# EAGLE design ConnectBox_Charger (EAGLE 9.2.2)
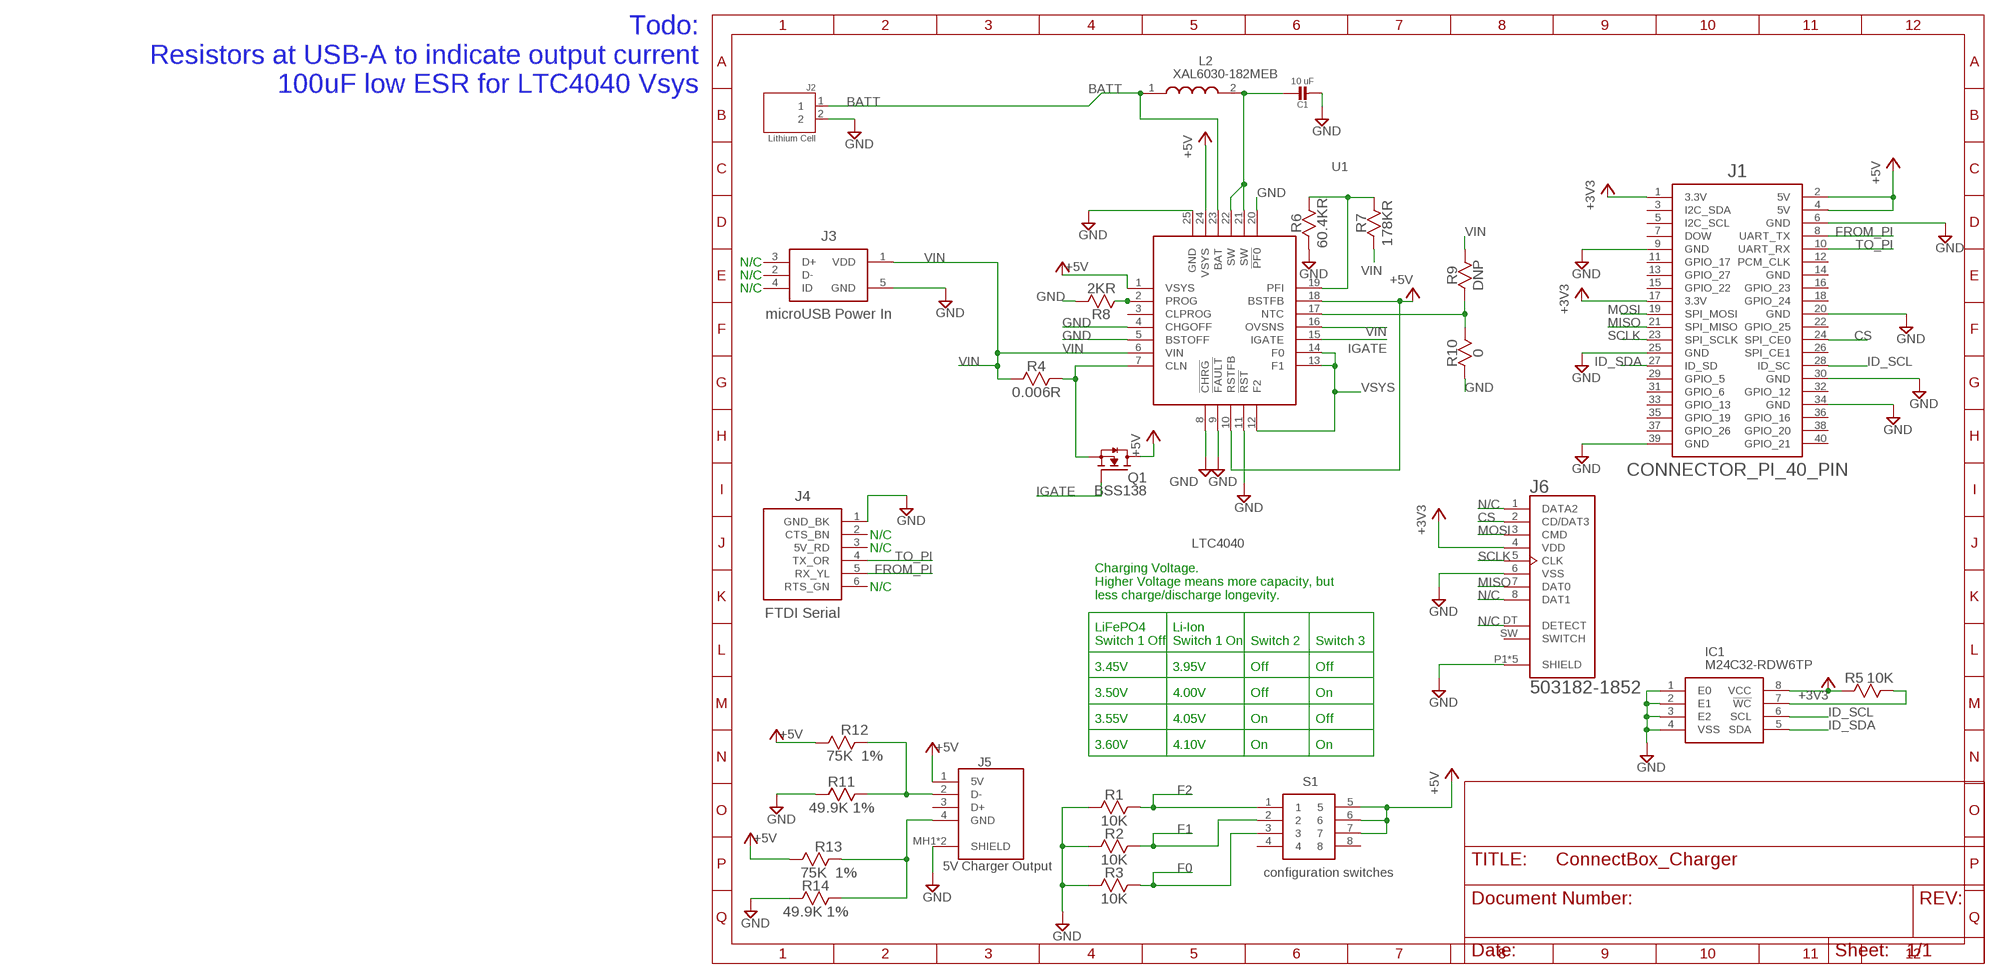
[diagram p0: schematic, sheet 1]

## Parts
C1  10 uF  MICROBUILDER_CAP_CERAMIC0805_10MGAP  [MICROBUILDER_0805_10MGAP]
IC1  M24C32-RDW6TP  [SOP65P640X120-8N]
J1  CONNECTOR_PI_40_PIN  [2X20]
J2  Lithium Cell  S2B-PH-SM4-TB(LF)(SN)  [JST_S2B-PH-SM4-TB(LF)(SN)]
J3  microUSB Power In  10118194-0001LF  [FRAMATOME_10118194-0001LF]
J4  FTDI Serial  CONNECTOR-6-FTDI  [ESQ-106-XX-X-S]
J5  5V Charger Output  SS-52100-001  [SS52100001]
J6  503182-1852  [MOLEX_503182-1852]
L2  XAL6030-182MEB  [XAL6030182MEB]
Q1  BSS138  [BSS138]
R1  10K  RESISTOR0603  [RESC1608X55L25N]
R2  10K  RESISTOR0603  [RESC1608X55L25N]
R3  10K  RESISTOR0603  [RESC1608X55L25N]
R4  0.006R  RESISTOR0603  [RESC1608X55L25N]
R5  10K  RESISTOR0603  [RESC1608X55L25N]
R6  60.4KR  RESISTOR0603  [RESC1608X55L25N]
R7  178KR  RESISTOR0603  [RESC1608X55L25N]
R8  2KR  RESISTOR0603  [RESC1608X55L25N]
R9  DNP  RESISTOR0603  [RESC1608X55L25N]
R10  0  RESISTOR0603  [RESC1608X55L25N]
R11  49.9K 1%  RESISTOR0603  [RESC1608X55L25N]
R12  75K 1%  RESISTOR0603  [RESC1608X55L25N]
R13  75K 1%  RESISTOR0603  [RESC1608X55L25N]
R14  49.9K 1%  RESISTOR0603  [RESC1608X55L25N]
S1  configuration switches  219-4LPST  [219-4LPST]
U1  LTC4040  [QFN50P500X400X80-25N]

## Nets
+3V3: IC1.8(VCC) J1.1(3.3V) J1.17(3.3V) J6.4(VDD) R5.2
+5V: J1.2(5V) J1.4(5V) J5.1(5V) Q1.D R12.2 R13.2 S1.5 S1.6 S1.7 U1.1(VSYS) U1.10(RSTFB) U1.18(BSTFB) U1.24(VSYS)
BATT: J2.1 L2.1 U1.23(BAT)
CS: J1.24(SPI_CE0) J6.2(CD/DAT3)
F0: R3.2 S1.3
F1: R2.2 S1.2
F2: R1.2 S1.1
FROM_PI: J1.8(UART_TX) J4.5(RX_YL)
GND [wide]: C1.2 IC1.1(E0) IC1.2(E1) IC1.3(E2) IC1.4(VSS) J1.6(GND) J1.9(GND) J1.20(GND) J1.25(GND) J1.30(GND) J1.34(GND) J1.39(GND) J2.2 J3.5(GND) J4.1(GND_BK) J5.MH1(SHIELD) J5.MH2(SHIELD) J6.6(VSS) J6.P1(SHIELD) J6.P2(SHIELD) J6.P3(SHIELD) J6.P4(SHIELD) J6.P5(SHIELD) R1.1 R2.1 R3.1 R6.1 R8.2 R10.1 R11.2 R14.2 U1.4(CHGOFF) U1.5(BSTOFF) U1.8(!CHRG) U1.9(!FAULT) U1.11(!RST) U1.20(!PF0) U1.25(GND)
ID_SCL: IC1.6(SCL) J1.28(ID_SC)
ID_SDA: IC1.5(SDA) J1.27(ID_SD)
IGATE: Q1.G U1.15(IGATE)
MISO: J1.21(SPI_MISO) J6.7(DAT0)
MOSI: J1.19(SPI_MOSI) J6.3(CMD)
N$2: Q1.S R4.2 U1.7(CLN)
N$3: IC1.7(!WC) R5.1
N$4: R6.2 R7.2 U1.19(PFI)
N$5 [wide]: C1.1 L2.2 U1.21(SW) U1.22(SW)
N$6: R8.1 U1.2(PROG)
N$8 [wide]: J5.4(GND) R13.1 R14.1
N$9: R9.1 R10.2 U1.17(NTC)
N$11: J5.2(D-) R11.1 R12.1
N/C: J6.1(DATA2) J6.8(DAT1) J6.DT(DETECT)
SCLK: J1.23(SPI_SCLK) J6.5(CLK)
TO_PI: J1.10(UART_RX) J4.4(TX_OR)
VIN: J3.1(VDD) R4.1 R7.1 R9.2 U1.6(VIN) U1.16(OVSNS)
VSYS: U1.12(F2) U1.13(F1) U1.14(F0)
Unconnected: J1.3(I2C_SDA) J1.5(I2C_SCL) J1.7(DOW) J1.11(GPIO_17) J1.12(PCM_CLK) J1.13(GPIO_27) J1.14(GND) J1.15(GPIO_22) J1.16(GPIO_23) J1.18(GPIO_24) J1.22(GPIO_25) J1.26(SPI_CE1) J1.29(GPIO_5) J1.31(GPIO_6) J1.32(GPIO_12) J1.33(GPIO_13) J1.35(GPIO_19) J1.36(GPIO_16) J1.37(GPIO_26) J1.38(GPIO_20) J1.40(GPIO_21) J3.2(D-) J3.3(D+) J3.4(ID) J4.2(CTS_BN) J4.3(5V_RD) J4.6(RTS_GN) J5.3(D+) J6.SW(SWITCH) S1.4 S1.8 U1.3(CLPROG)

## Notes on the sheet
- Todo:
  Resistors at USB-A to indicate output current
  100uF low ESR for LTC4040 Vsys
- N/C
- N/C
- N/C
- N/C
- N/C
- N/C
- Charging Voltage.
  Higher Voltage means more capacity, but
  less charge/discharge longevity.
- LiFePO4
  Switch 1 Off
- Li-Ion
  Switch 1 On
- Switch 2 | Switch 3
- 3.45V | 3.95V | Off | Off
- 3.50V | 4.00V | Off | On
- 3.55V | 4.05V | On | Off
- 3.60V | 4.10V | On | On

## Library data of the parts
C1 = Adafruit LoRa Radio Bonnet with OLED:MICROBUILDER_CAP_CERAMIC: Ceramic Capacitors For new designs, use the packages preceded by an '_' character since they are more reliable: The following footprints should be used on most boards: _0402 - Standard footprint for regular board layouts _0603 - Standard footprint for regular board layouts _0805 - Standard footprint for regular board layouts _1206 - Standard footprint for regular board layouts For extremely tight-pitch boards where space is at a premium, the following 'micro-pitch' footprints can be used (smaller pads, no silkscreen outline, etc.): _0402MP - Micro-pitch footprint for very dense/compact boards _0603MP - Micro-pitch footprint for very dense/compact boards _0805MP - Micro-pitch footprint for very dense/compact boards _1206MP - Micro-pitch footprint for very dense/compact boards
IC1 = ConnectBox_2019:M24C32-RDW6TP: STMICROELECTRONICS - M24C32-RDW6TP - EEPROM, 32KBIT, I2C, 1MHZ, TSSOP-8 Source: Datasheet <http://www.st.com/content/ccc/resource/technical/document/datasheet/80/4e/8c/54/f2/63/4c/4a/CD00001012.pdf/files/CD00001012.pdf/jcr:content/translations/en.CD00001012.pdf>; DESCRIPTION: STMICROELECTRONICS - M24C32-RDW6TP - EEPROM, 32KBIT, I2C, 1MHZ, TSSOP-8; HEIGHT: 1.2mm; MANUFACTURER_NAME: STMicroelectronics; MANUFACTURER_PART_NUMBER: M24C32-RDW6TP; MOUSER_PART_NUMBER: 511-M24C32-RDW6TP; MOUSER_PRICE-STOCK: https://www.mouser.com/Search/Refine.aspx?Keyword=511-M24C32-RDW6TP
J1 = ConnectBox_2019:CONNECTOR_PI_40_PIN
J2 = ConnectBox_2019:S2B-PH-SM4-TB(LF)(SN): PH Series 2 Position 2 mm Pitch Surface Mount Side Entry Shrouded Header; AVAILABILITY: Unavailable; DESCRIPTION: PH Series 2 Position 2 mm Pitch Surface Mount Side Entry Shrouded Header; MF: JST Sales; MP: S2B-PH-SM4-TB_LF__SN_; PACKAGE: FakePackage u; PRICE: None
J3 = ConnectBox_2019:10118194-0001LF: Conn Micro USB Type B RCP 5 POS 0.65mm Solder RA SMD 5 Terminal 1 Port T/R from SnapEDA; AVAILABILITY: Good; DESCRIPTION: Conn Micro USB Type B RCP 5 POS 0.65mm Solder RA SMD 5 Terminal 1 Port T/R; MF: FCI; MP: 10118194-0001LF; PACKAGE: DIP-4 FCI; PRICE: 0.24 USD
J4 = ConnectBox_2019:CONNECTOR-6-FTDI
J5 = ConnectBox_2019:SS-52100-001: STEWART CONNECTOR - SS-52100-001 - USB CONN, 2.0 TYPE A, RCPT, 4POS, TH Source: Datasheet <https://componentsearchengine.com/Datasheets/1/SS-52100-001.pdf>; DESCRIPTION: STEWART CONNECTOR - SS-52100-001 - USB CONN, 2.0 TYPE A, RCPT, 4POS, TH; HEIGHT: 6.9mm; MANUFACTURER_NAME: Bel-Stewart; MANUFACTURER_PART_NUMBER: SS-52100-001; MOUSER_PART_NUMBER: 530-SS-52100-001; MOUSER_PRICE-STOCK: https://www.mouser.com/Search/Refine.aspx?Keyword=530-SS-52100-001
J6 = 503182-1852:503182-1852: Conn Micro SD Card M 8 POS 1.09mm Solder RA SMD Embossed T/R 0.5A/Contact; DESCRIPTION: MICRO SD NORMAL ULTRALOWPRO8CKTE; DIGI-KEY_PART_NUMBER: WM12834CT-ND; DIGI-KEY_PURCHASE_URL: https://www.digikey.com/product-detail/en/molex/5031821852/WM12834CT-ND/5823232?utm_source=snapeda&utm_medium=aggregator&utm_campaign=symbol; MF: Molex; MP: 5031821852; PACKAGE: None
L2 = ConnectBox_2019:XAL6030-182MEB: Fixed Inductors 1.8uH 20% 14A 10.52mOhms AEC-Q200 Source: Datasheet <https://www.coilcraft.com/pdfs/xal60xx.pdf>; DESCRIPTION: Fixed Inductors 1.8uH 20% 14A 10.52mOhms AEC-Q200; HEIGHT: 3.1mm; MANUFACTURER_NAME: COILCRAFT; MANUFACTURER_PART_NUMBER: XAL6030-182MEB; MOUSER_PART_NUMBER: 994-XAL6030-182MEB; MOUSER_PRICE-STOCK: https://www.mouser.com/Search/Refine.aspx?Keyword=994-XAL6030-182MEB
Q1 = APU_ENGR480_UPS_EAGLE_Library:BSS138: BSS138 N-Channel Logic Level Enhancement Mode Field Effect Transistor from SnapEDA; AVAILABILITY: Good; DESCRIPTION: B138 Series 50 V 6 Ohms N-Ch Logic Level Enhancement Mode FET - SOT-23-3; MF: Fairchild Semiconductor; MP: BSS138; PACKAGE: SOT-23-3 Fairchild Semiconductor; PRICE: 19.46 USD
R1-R14 = ConnectBox_2019:RESISTOR
S1 = ConnectBox_2019:219-4LPST: Series 219, SMD DIP-switch Source: Datasheet <http://www.ctscorp.com/wp-content/uploads/2015/11/219.pdf>; DESCRIPTION: Series 219, SMD DIP-switch; HEIGHT: mm; MANUFACTURER_NAME: CTS; MANUFACTURER_PART_NUMBER: 219-4LPST; MOUSER_PART_NUMBER: 774-2194LPST; MOUSER_PRICE-STOCK: https://www.mouser.com/Search/Refine.aspx?Keyword=774-2194LPST; RS_PART_NUMBER: 1774220; RS_PRICE-STOCK: http://uk.rs-online.com/web/p/products/1774220
U1 = ConnectBox_2019:LTC4040

## Net classes
1 wide: width 0.076 mm

## Board
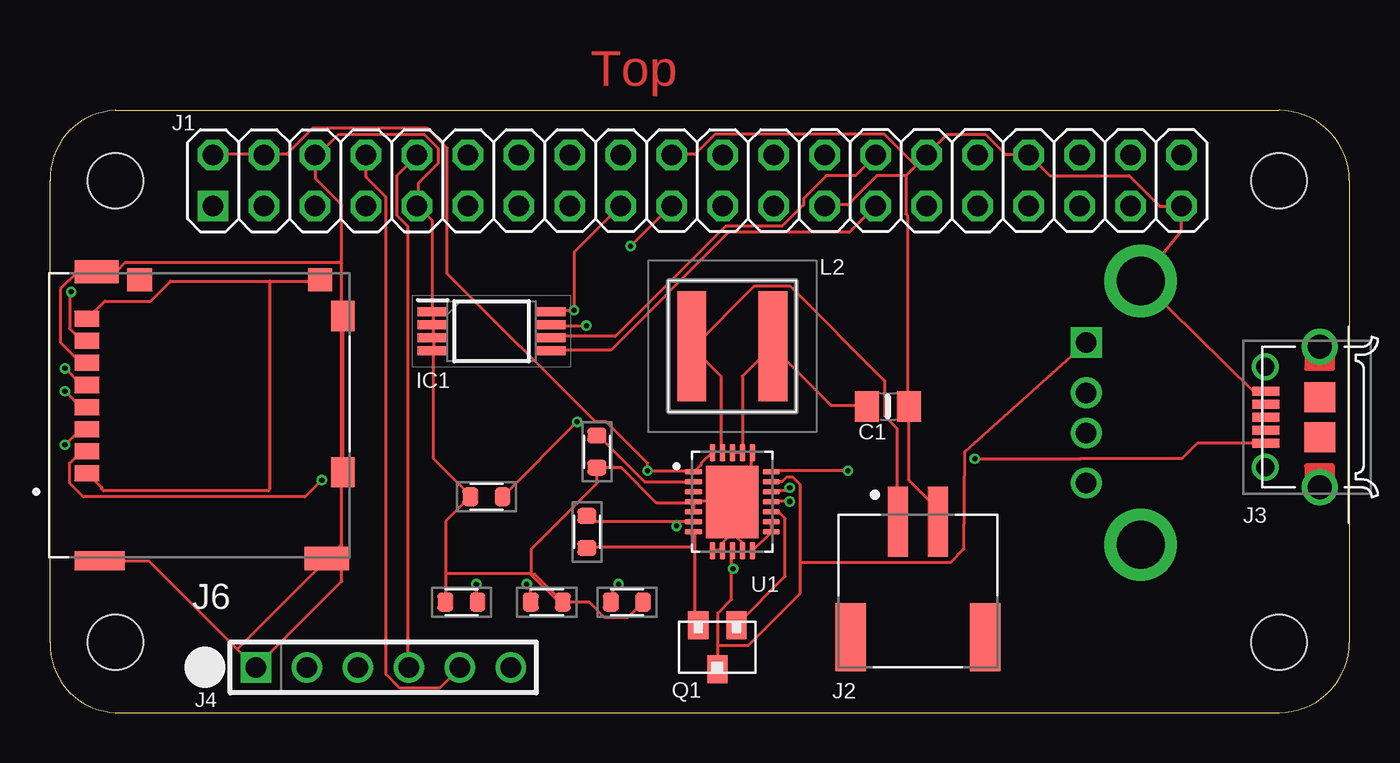
[diagram p1: board, top side]
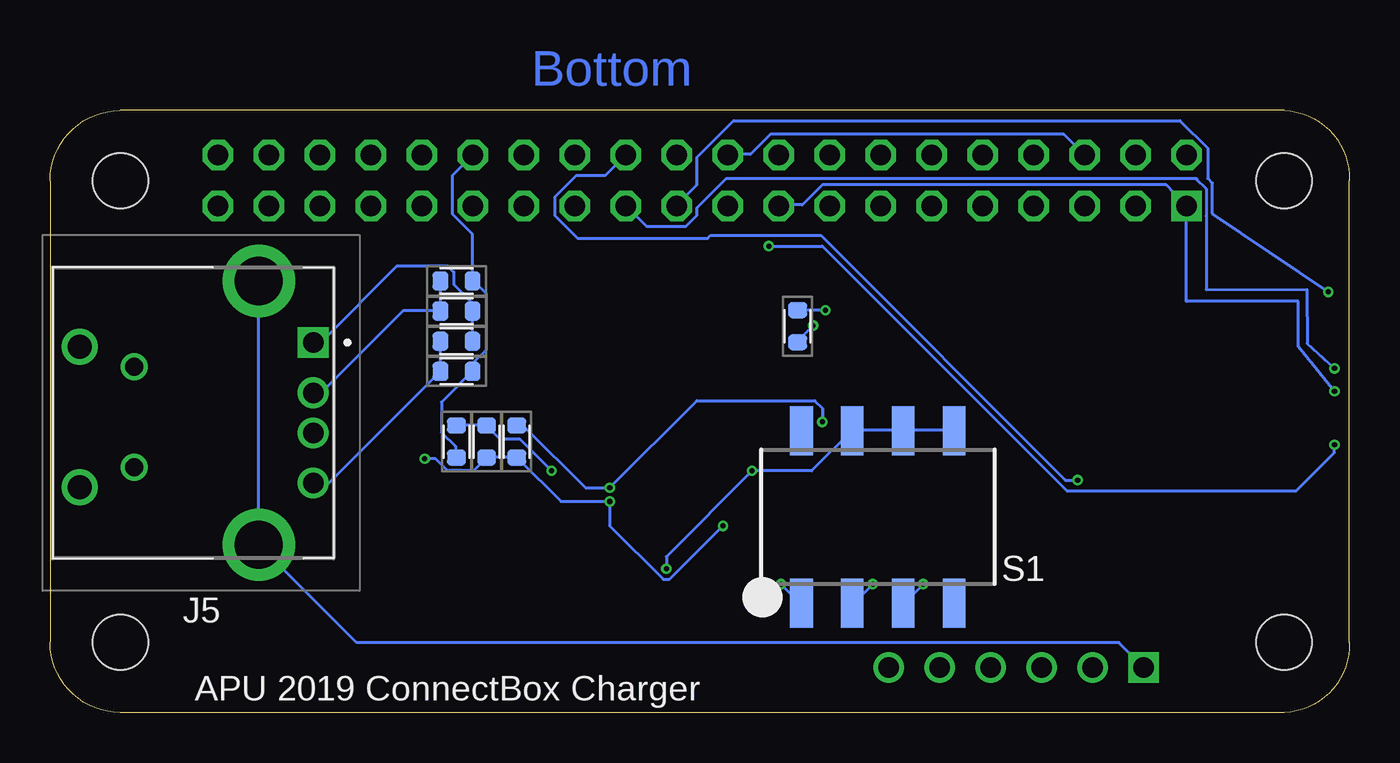
[diagram p2: board, bottom side, seen from below]

Size 64.75 x 30 mm. Coordinates in mm from the lower left corner, seen from the top.
Outline: 0,3.5 arc90 3.25,0 61.25,0 arc90 64.75,3.5 64.75,26.5 arc90 61.25,30 3.25,30 arc90 0,26.5 0,3.5
Copper layers (1*16): Top 0.035559375mm / dielectric 1.6mm / Bottom 0.035559375mm
Design rules "oshpark-2layer *": minimum track width 6mil, minimum drill 10mil, track to track 6mil, track to pad 6mil, pad to pad 6mil, via to via 6mil, smd to smd 6mil, copper to edge 15mil, drill to drill 6mil, minimum pad ring 5mil, minimum via ring 5mil, stop-mask expansion 2.5mil, vias tented up to drill 20mil, thermal gap 10mil
Holes 2.75 mm at 3.25,3.5 61.25,3.5 61.25,26.5 3.25,26.5
bKeepout: area 0.1,0.4 to 6.3,6.6; area 0.1,23.4 to 6.3,29.6; area 58.1,23.4 to 64.3,29.6; area 58.1,0.4 to 64.3,6.6
tRestrict: area 0.1,0.4 to 6.3,6.6; area 0.1,23.4 to 6.3,29.6; area 58.1,23.4 to 64.3,29.6; area 58.1,0.4 to 64.3,6.6

### Footprints (pad centres in the part's own frame; a part is rotated, then mirrored left to right if it is on the bottom)
MICROBUILDER_0805_10MGAP = smd 1.2 x 1.5: 1 -1.05,0; 2 1.05,0
SOP65P640X120-8N = smd 1.475 x 0.45: 1 -2.938,0.975; 2 -2.938,0.325; 3 -2.938,-0.325; 4 -2.938,-0.975; 5 2.938,-0.975; 6 2.938,-0.325; 7 2.938,0.325; 8 2.938,0.975
2X20 = drill 1.016 square: 1 -24.13,-1.27 | drill 1.016 octagon: 2 -24.13,1.27; 3 -21.59,-1.27; 4 -21.59,1.27; 5 -19.05,-1.27; 6 -19.05,1.27; 7 -16.51,-1.27; 8 -16.51,1.27; 9 -13.97,-1.27; 10 -13.97,1.27; 11 -11.43,-1.27; 12 -11.43,1.27; 13 -8.89,-1.27; 14 -8.89,1.27; 15 -6.35,-1.27; 16 -6.35,1.27; 17 -3.81,-1.27; 18 -3.81,1.27; 19 -1.27,-1.27; 20 -1.27,1.27; 21 1.27,-1.27; 22 1.27,1.27; 23 3.81,-1.27; 24 3.81,1.27; 25 6.35,-1.27; 26 6.35,1.27; 27 8.89,-1.27; 28 8.89,1.27; 29 11.43,-1.27; 30 11.43,1.27; 31 13.97,-1.27; 32 13.97,1.27; 33 16.51,-1.27; 34 16.51,1.27; 35 19.05,-1.27; 36 19.05,1.27; 37 21.59,-1.27; 38 21.59,1.27; 39 24.13,-1.27; 40 24.13,1.27
JST_S2B-PH-SM4-TB(LF)(SN) = smd 1 x 3.5: 1 -1,0; 2 1,0 | smd 1.5 x 3.4: S1 -3.35,-5.75; S2 3.35,-5.75
FRAMATOME_10118194-0001LF = smd 0.45 x 1.35: 1 -1.3,2.675; 2 -0.65,2.675; 3 0,2.675; 4 0.65,2.675; 5 1.3,2.675 | drill 0.9: P$6 -2.5,2.7; P$7 2.5,2.7 | drill 1.2: P$8 -3.5,0; P$9 3.5,0 | smd 1.5 x 1.55: P$10 -1,0; P$11 1,0
ESQ-106-XX-X-S = drill 1.016 pad 1.524 square: 1 0,0 | drill 1.016 pad 1.524: 2 2.54,0; 3 5.08,0; 4 7.62,0; 5 10.16,0; 6 12.7,0
SS52100001 = drill 1.02 pad 1.53 square: 1 0,0 | drill 1.02 pad 1.53: 2 2.5,0; 3 4.5,0; 4 7,0 | drill 2.4 pad 3.6: MH1 -3.07,-2.71; MH2 10.07,-2.71
MOLEX_503182-1852 = smd 0.8 x 1.24: 1 -2.9,6.355; 2 -1.8,6.355; 3 -0.7,6.355; 4 0.4,6.355; 5 1.5,6.355; 6 2.6,6.355; 7 3.7,6.355; 8 4.8,6.355 | smd 1.16 x 1.2: DT 6.74,-5.275 | smd 0.95 x 2.5: P1 -7.245,5.725 | smd 1.15 x 2.2: P2 7.145,5.875; P3 -7.145,-5.605 | smd 1.5 x 1.15: P4 -2.84,-6.4; P5 4.94,-6.4 | smd 1.16 x 1.25: SW 6.74,3.725
XAL6030182MEB = smd 1.43 x 5.5: 1 -2.02,0; 2 2.02,0
BSS138 = smd 1 x 1.4: D 0,1.1; G -0.95,-1.1; S 0.95,-1.1
RESC1608X55L25N = smd 0.8 x 0.95: 1 -0.8,0; 2 0.8,0
219-4LPST = smd 1.13 x 2.44: 1 -3.81,-4.3; 2 -1.27,-4.3; 3 1.27,-4.3; 4 3.81,-4.3; 5 3.81,4.3; 6 1.27,4.3; 7 -1.27,4.3; 8 -3.81,4.3
QFN50P500X400X80-25N = smd 0.86 x 0.27: 1 -1.935,1.5; 2 -1.935,1; 3 -1.935,0.5; 4 -1.935,0; 5 -1.935,-0.5; 6 -1.935,-1; 7 -1.935,-1.5; 13 1.935,-1.5; 14 1.935,-1; 15 1.935,-0.5; 16 1.935,0; 17 1.935,0.5; 18 1.935,1; 19 1.935,1.5 | smd 0.27 x 0.86: 8 -1,-2.435; 9 -0.5,-2.435; 10 0,-2.435; 11 0.5,-2.435; 12 1,-2.435; 20 1,2.435; 21 0.5,2.435; 22 0,2.435; 23 -0.5,2.435; 24 -1,2.435 | smd 2.61 x 3.61: 25 0,0

### Placement (x,y rotation side)
C1  41.75,15.25 0 top
IC1  22,19 0 top
J1  32.25,26.5 0 top
J2  43.25,9.5 0 top
J3  63.27,14.72 90 top
J4  10.25,2.25 0 top
J5  51.64,18.43 270 bottom
J6  8.19,14.82 90 top
L2  34,18.25 0 top
Q1  33.25,3.25 180 top
R1  28.75,5.5 180 top
R2  24.75,5.5 180 top
R3  20.5,5.5 0 top
R4  26.75,9 270 top
R5  27.5,19.25 90 bottom
R6  44.5,13.5 90 bottom
R7  43,13.5 90 bottom
R8  27.25,13 270 top
R9  41.5,13.5 270 bottom
R10  21.75,10.75 0 top
R11  44.5,21.5 0 bottom
R12  44.5,20 0 bottom
R13  44.5,18.5 0 bottom
R14  44.5,17 0 bottom
S1  23.5,9.75 0 bottom
U1  34,10.5 0 top

### Tracks (layer width: path | path; a pad name or v marks a point on that pad's centre or on a via)
+3V3  (via drill 0.25)
  Top 0.152: IC1.8 24.97,20.04 v26.11,20.04 26.11,22.94 28.4,25.22 J1.17 | v0.74,16 1.5,15.24 1.81,15.24 J6.4
  Bottom 0.152: v26.11,20.04 27.49,20.04 R5.2 | J1.17 28.4,25.3 27.26,25.3 26.27,26.29 9.12,26.29 J1.1 8.12,20.49 2.56,20.49 2.54,18.22 v0.74,16
+5V  (via drill 0.25)
  Top 0.152: 33.96,7.16 33.96,5.64 33.28,4.95 33.28,3.35 | 33.96,7.16 33.96,8 U1.10 | 33.28,3.35 33.28,2.21 Q1.D | 37.39,7.47 37.39,5.94 34.8,3.35 33.28,3.35 | 37.39,7.47 37.39,11.35 37.01,11.73 36.71,11.73 36.48,11.51 U1.18 | 37.39,7.47 44.86,7.47 45.55,8.15 45.59,13 J5.1 | J1.2 8.13,27.81 10.65,27.81 J1.4 10.72,27.81 11.79,27.81 13.09,29.11 18.8,29.11 19.79,28.12 19.79,21.87 27.18,14.48 27.71,14.48 29.77,12.42 v29.77,12.04 32.06,12.04 U1.1 32.13,12.04 32.44,12.34 32.44,12.42 32.97,12.95 U1.24 | v34.04,7.16 33.96,7.16
  Bottom 0.152: R13.2 43.72,18.52 43.72,19.96 R12.2 43.72,20.04 43.72,20.42 44.63,21.34 44.63,21.95 44.94,22.25 47.45,22.25 51.27,18.43 J5.1 | S1.5 19.71,14.1 22.23,14.1 S1.6 22.3,14.1 24.74,14.1 S1.7 24.82,14.02 26.8,12.04 v29.77,12.04 34.04,7.77 v34.04,7.16
BATT
  Top 0.152: U1.23 33.43,12.95 33.43,16.76 31.98,18.21 L2.1 32.06,18.21 35.11,21.26 36.86,21.26 41.58,16.54 41.58,14.78 42.19,14.17 42.19,9.53 J2.1
CS  (via drill 0.25)
  Top 0.152: v13.54,11.58 12.7,10.74 1.66,10.74 0.97,11.43 0.97,12.42 1.5,12.95 1.81,12.95 J6.2
  Bottom 0.152: v13.54,11.58 14.15,11.58 26.34,23.77 31.83,23.77 31.98,23.62 38.46,23.62 39.6,24.77 39.6,25.68 38.54,26.75 37.09,26.75 36.1,27.74 J1.24
F0  (via drill 0.25)
  Top 0.152: v21.24,6.4 21.24,5.56 R3.2
  Bottom 0.152: v21.24,6.4 22.23,5.41 S1.3
F1  (via drill 0.25)
  Top 0.152: v23.75,6.4 23.91,6.25 23.91,5.56 R2.2
  Bottom 0.152: v23.75,6.4 24.74,5.41 S1.2
F2  (via drill 0.25)
  Top 0.152: v28.32,6.4 28.02,6.1 28.02,5.56 R1.2
  Bottom 0.152: v28.32,6.4 27.33,5.41 S1.1
FROM_PI
  Top 0.152: J1.8 15.75,27.74 15.75,26.67 16.74,25.68 16.74,1.91 17.43,1.22 19.41,1.22 20.4,2.21 J4.5
GND
  Top 0.152: J3.5 60.56,15.98 59.98,15.98 J5.MH1 56.37,24 56.37,25.22 J1.39 56.29,25.22 55.3,25.22 53.78,26.75 49.81,26.75 48.82,27.74 J1.34 48.75,27.81 47.6,27.81 46.61,28.8 44.71,28.8 43.72,27.81 J1.30 | J2.2 44.17,9.53 44.17,10.21 42.8,11.58 C1.2 42.73,15.32 42.73,24.77 42.65,24.84 42.65,26.75 | 42.65,26.75 41.2,26.75 39.76,25.3 38.61,25.3 J1.25 | 42.65,26.75 43.64,27.74 J1.30 | J1.20 30.99,27.81 32.13,27.81 33.13,28.8 41.58,28.8 43.11,27.28 J1.30 | U1.5 32.06,10.06 32.06,10.44 U1.4 | U1.4 31.98,10.44 30.23,10.44 28.48,12.19 R8.2 27.26,12.12 27.26,11.43 23.98,8.15 23.98,6.93 23.94,6.9 | U1.8 33.05,8.08 33.43,8.08 U1.9 33.43,8.15 33.43,8.38 33.81,8.76 34.04,8.76 | 34.04,8.76 34.19,8.76 34.5,8.46 34.5,8.08 U1.11 | U1.20 34.95,12.88 34.95,11.43 34.04,10.52 U1.25 | 34.04,8.76 34.04,10.44 U1.25 | U1.4 32.13,10.52 33.96,10.52 U1.25 | R2.1 25.58,5.49 26.88,5.49 27.64,4.72 28.78,4.72 29.54,5.49 R1.1 | 19.71,6.93 19.71,9.53 20.93,10.74 R10.1 20.93,10.82 19.11,12.65 19.11,17.98 IC1.4 19.11,18.06 19.11,18.67 IC1.3 19.11,18.75 19.11,19.28 IC1.2 19.11,19.36 19.11,19.96 IC1.1 19.03,20.04 19.03,24.54 18.34,25.22 J1.9 18.34,25.3 18.34,26.36 19.33,27.36 19.33,28.12 18.65,28.8 14.38,28.8 13.31,27.74 J1.6 13.24,27.74 13.24,26.59 14.53,25.3 14.53,22.4 | 19.71,6.93 19.71,5.56 | 19.71,5.56 R3.1 19.71,5.51 19.71,5.56 | 23.94,6.9 23.91,6.93 19.71,6.93 | 23.94,6.9 25.28,5.56 25.51,5.56 R2.1 | 9.31,3.16 10.19,2.29 J4.1 14.53,6.53 14.53,19.81 | 9.31,3.16 4.93,7.54 2.49,7.54 J6.P1 | J6.6 1.81,17.45 1.5,17.45 0.51,18.44 0.51,21.11 1.35,21.95 2.27,21.95 J6.P2 2.34,22.02 3.33,22.02 3.71,22.4 14.53,22.4
  Top 0.152: 14.53,19.81 14.53,22.4 | 14.53,19.81 J6.P5 14.61,19.74 14.61,12.04 J6.P4 14.53,11.96 14.53,8.38 13.85,7.7 J6.P3 13.77,7.62 9.31,3.16 | 23.94,6.9 24.15,6.9 R2.1
  Bottom 0.152: R6.1 44.56,12.72 44.56,13.26 45.24,13.95 45.24,15.47 43.72,16.99 R14.2 43.64,17.07 43.64,17.45 43.03,18.06 43.03,20.88 43.64,21.49 R11.2 43.72,21.57 43.72,23.85 44.71,24.84 44.71,26.75 43.72,27.74 J1.30 | J1.20 30.92,27.81 29.85,27.81 28.86,28.8 14.23,28.8 13.24,27.81 J1.6 | J5.MH1 J5.MH2 49.47,3.48 11.48,3.48 J4.1
ID_SCL
  Top 0.152: IC1.6 24.97,18.75 28.17,18.75 33.66,24.23 36.48,24.23 37.55,25.3 37.55,25.6 38.69,26.75 40.14,26.75 41.13,27.74 J1.28
ID_SDA
  Top 0.152: IC1.5 24.97,18.06 27.94,18.06 33.81,23.93 39.83,23.93 41.13,25.22 J1.27
IGATE
  Top 0.152: U1.15 35.95,9.98 36.33,9.98 36.63,9.68 36.63,6.78 34.27,4.42 Q1.G
MISO  (via drill 0.25)
  Top 0.152: v1.04,20.95 0.97,20.88 0.97,19.13 1.5,18.59 1.81,18.59 J6.7
  Bottom 0.152: J1.21 33.51,25.3 32.52,26.29 32.52,27.66 30.69,29.49 8.44,29.49 7.07,28.12 7.07,26.61 6.85,26.39 6.83,26.39 6.83,24.86 v1.04,20.95
MOSI  (via drill 0.25)
  Top 0.152: v0.74,13.34 1.5,14.1 1.81,14.1 J6.3 | v28.93,23.24 30.92,25.22 J1.19
  Bottom 0.152: v0.74,13.34 0.74,12.95 2.65,11.05 14.08,11.05 26.04,23.02 26.27,23.24 v28.93,23.24
N$2
  Top 0.152: 32.13,8.23 32.13,4.57 32.29,4.42 Q1.S | 32.13,8.23 32.13,8.99 U1.7 | 32.13,8.23 26.8,8.23 R4.2
N$3  (via drill 0.25)
  Top 0.152: v26.73,19.28 24.97,19.28 IC1.7
  Bottom 0.152: v26.73,19.28 27.49,18.52 R5.1
N$4  (via drill 0.25)
  Top 0.152: v39.76,12.04 35.95,12.04 U1.19
  Bottom 0.152: v39.76,12.04 41.35,13.64 42.35,13.64 42.95,14.25 R7.2 43.03,14.33 44.48,14.33 R6.2
N$5
  Top 0.152: U1.22 34.04,12.95 34.5,12.95 U1.21 34.5,13.03 34.5,16.76 35.95,18.21 L2.2 36.02,18.21 38.92,15.32 40.67,15.32 C1.1
N$6
  Top 0.152: U1.2 29.62,11.51 27.26,13.87 R8.1
N$8
  Bottom 0.152: R13.1 45.32,18.44 45.32,17.07 R14.1 50.87,11.43 J5.4
N$9  (via drill 0.25)
  Top 0.152: v36.86,11.2 36.71,11.05 35.95,11.05 U1.17 | v26.27,14.48 22.61,10.82 R10.2
  Bottom 0.152: R9.1 41.43,14.25 41.13,14.25 38.08,11.2 v36.86,11.2 32.52,15.54 26.65,15.54 26.27,15.16 v26.27,14.48
N$11
  Bottom 0.152: R11.1 45.32,21.49 45.32,20.04 R12.1 45.39,20.04 47.15,20.04 51.26,15.93 J5.2
N/C
  Top 0.152: 10.95,21.49 6,21.49 5.01,20.5 2.72,20.5 1.88,19.66 J6.8 | 10.95,21.49 13.39,21.49 J6.DT | 10.95,21.49 10.95,11.12 10.88,11.05 2.65,11.05 2.57,11.12 2.57,11.2 1.88,11.89 J6.1
SCLK  (via drill 0.25)
  Top 0.152: v0.74,17.14 1.5,16.38 1.81,16.38 J6.5
  Bottom 0.152: J1.23 36.02,25.22 35.03,24.23 33.05,24.23 32.52,24.77 32.52,25.15 31.07,26.59 7.6,26.59 7.6,26.56 7.13,26.09 7.13,24.73 7.13,21.07 2.11,21.08 2.1,18.38 v0.74,17.14
TO_PI
  Top 0.152: J4.4 17.81,2.29 17.81,24.23 17.28,24.77 17.28,26.75 18.27,27.74 J1.10
VIN  (via drill 0.25)
  Top 0.152: 31.22,9.53 27.03,9.53 26.8,9.75 R4.1 | 31.22,9.53 32.06,9.53 U1.6 | v36.86,10.52 35.95,10.52 U1.16 | v46.08,12.65 51.34,12.65 56.41,12.65 57.18,13.42 J3.1 | v31.22,9.3 31.22,9.53
  Bottom 0.152: v46.08,12.65 45.55,12.65 44.94,12.04 43.64,12.04 43.03,12.65 R7.1 42.95,12.72 41.51,12.72 R9.2 41.43,12.65 39.3,10.52 v36.86,10.52 36.86,9.3 34.19,6.63 33.89,6.63 v31.22,9.3
VSYS
  Top 0.152: U1.12 35.03,8.08 U1.13 35.95,9.07 35.95,9.45 U1.14

### Text on the board
Top: Top
Bottom: Bottom
bPlace: APU 2019 ConnectBox Charger